# Altium schematic sheet 20.SchDoc
size 420 x 297 mm
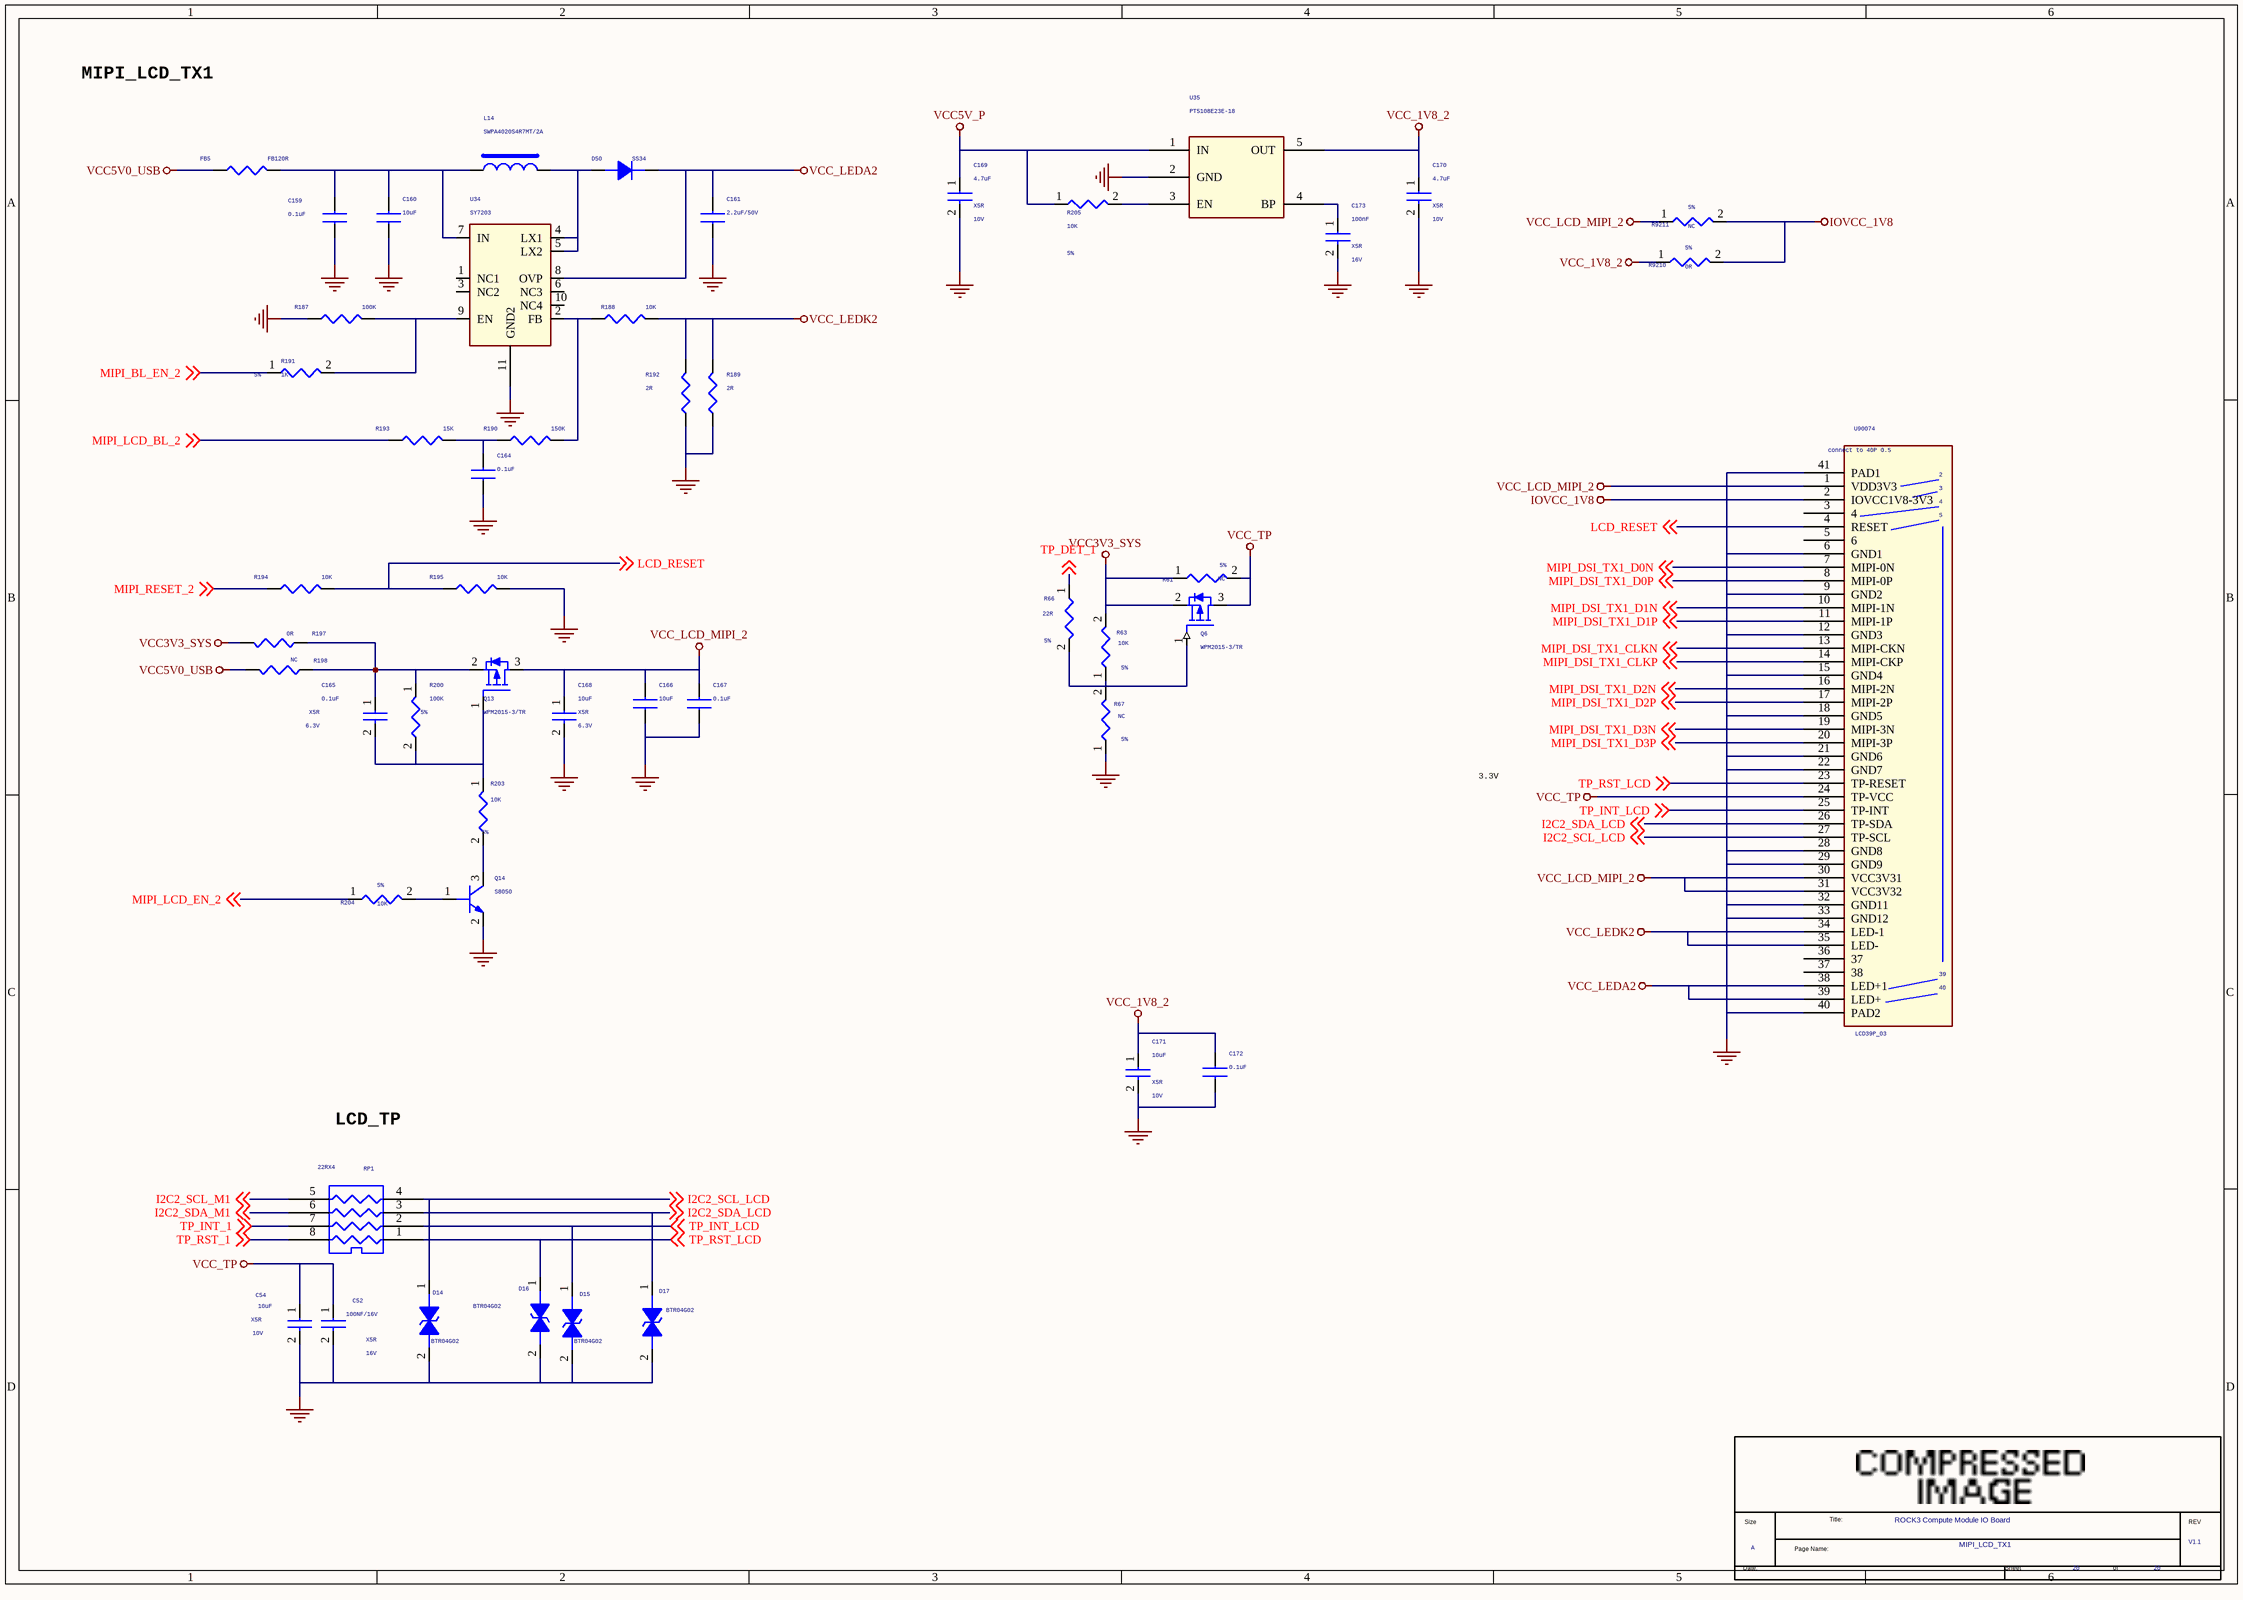
[diagram p0: 20.SchDoc]

## Parts
*  Page Count: 20  Page Size: A  Title: ROCK3 Compute Module IO Board  RevCode: V1.1  Doc: MIPI_LCD_TX1  (hidden comment: radxa_gong)  (graphical)
C52  100NF/16V  Voltage: 16V  Dielectric: X5R  [C0402]
C54  10uF  Voltage: 10V  Dielectric: X5R  [C0603]
C159  0.1uF  [C0603]
C160  10uF  [C0603]
C161  2.2uF/50V  [C0603]
C164  0.1uF  [C0603]
C165  0.1uF  Voltage: 6.3V  Dielectric: X5R  [C0402]
C166  10uF  [C0603]
C167  0.1uF  [C0603]
C168  10uF  Voltage: 6.3V  Dielectric: X5R  [C0603]
C169  4.7uF  Voltage: 10V  Dielectric: X5R  [C0603]
C170  4.7uF  Voltage: 10V  Dielectric: X5R  [C0603]
C171  10uF  Voltage: 10V  Dielectric: X5R  [C0603]
C172  0.1uF  [C0603]
C173  100nF  Voltage: 16V  Dielectric: X5R  [C0402]
D14  BTR04G02  [ESD0402_1xD5]
D15  BTR04G02  [ESD0402_1xD5]
D16  BTR04G02  [ESD0402_1xD5]
D17  BTR04G02  [ESD0402_1xD5]
D50  SS34  [DO214AC]
FB5  FB120R  [R0603]
L14  SWPA4020S4R7MT/2A  [IND-4X4]
Q6  WPM2015-3/TR  [SOT23]
Q13  WPM2015-3/TR  [SOT23]
Q14  S8050  [SOT23]
R61  NC  Tolerance: 5%  [R0402]
R63  10K  Tolerance: 5%  [R0402]
R66  22R  Tolerance: 5%  [R0402]
R67  NC  Tolerance: 5%  [R0402]
R187  100K  [R0402]
R188  10K  [R0402]
R189  2R  [R0805]
R190  150K  [R0402]
R191  1K  Tolerance: 5%  [R0402]
R192  2R  [R0805]
R193  15K  [R0402]
R194  10K  [R0402]
R195  10K  [R0402]
R197  0R  [R0603]
R198  NC  [R0603]
R200  100K  Tolerance: 5%  [R0402]
R203  10K  Tolerance: 5%  [R0402]
R204  10K  Tolerance: 5%  [R0402]
R205  10K  Tolerance: 5%  [R0402]
R9210  0R  Tolerance: 5%  [R0402]
R9211  NC  Tolerance: 5%  [R0402]
RP1  22RX4  [RN8P4RC]
U34  SY7203  [QFN8-2X2]
U35  PT5108E23E-18  [SOT25]
U90074  LCD39P_03  [LCD39PIN-ok]

## Nets
GND: C52.2 C54.2 C159.2 C160.2 C161.2 C164.1 C166.2 C167.2 C168.2 C169.2 C170.2 C171.2 C172.2 C173.2 D14.2 D15.2 D16.2 D17.2 Q14.2(EMITTER) R67.1 R187.1 R189.2 R192.2 R195.2 U34.11(GND2) U35.2(GND) U90074.6(GND1) U90074.9(GND2) U90074.12(GND3) U90074.15(GND4) U90074.18(GND5) U90074.21(GND6) U90074.22(GND7) U90074.28(GND8) U90074.29(GND9) U90074.32(GND11) U90074.33(GND12) U90074.40(PAD2) U90074.41(PAD1)
IOVCC_1V8: R9210.2 R9211.2 U90074.2(IOVCC1V8-3V3)
VCC3V3_SYS: Q6.2(SOURCE) R61.1 R63.2 R197.1
VCC5V0_USB: FB5.1 R198.1
VCC5V_P: C169.1 R205.1 U35.1(IN)
VCC_1V8_2: C170.1 C171.1 C172.1 R9210.1 U35.5(OUT)
VCC_LCD_MIPI_2: C166.1 C167.1 C168.1 Q13.3(DRAIN) R9211.1 U90074.1(VDD3V3) U90074.30(VCC3V31) U90074.31(VCC3V32)
VCC_LEDA2: C161.1 D50.2(K) U34.8(OVP) U90074.38(LED+1) U90074.39(LED+)
VCC_LEDK2: R188.2 R189.1 R192.1 U90074.34(LED-1) U90074.35(LED-)
VCC_TP: C52.1 C54.1 Q6.3(DRAIN) R61.2 U90074.24(TP-VCC)
I2C2_SCL_LCD: D14.1 RP1.4(R4) U90074.27(TP-SCL) ; off-sheet I2C2_SCL_LCD
I2C2_SCL_M1: RP1.5(R4) ; off-sheet I2C2_SCL_M1
I2C2_SDA_LCD: D17.1 RP1.3(R3) U90074.26(TP-SDA) ; off-sheet I2C2_SDA_LCD
I2C2_SDA_M1: RP1.6(R3) ; off-sheet I2C2_SDA_M1
LCD_RESET: R194.2 R195.1 U90074.4(RESET) ; off-sheet LCD_RESET
MIPI_BL_EN_2: R191.1 ; off-sheet MIPI_BL_EN_2
MIPI_DSI_TX1_CLKN: U90074.13(MIPI-CKN) ; off-sheet MIPI_DSI_TX1_CLKN
MIPI_DSI_TX1_CLKP: U90074.14(MIPI-CKP) ; off-sheet MIPI_DSI_TX1_CLKP
MIPI_DSI_TX1_D0N: U90074.7(MIPI-0N) ; off-sheet MIPI_DSI_TX1_D0N
MIPI_DSI_TX1_D0P: U90074.8(MIPI-0P) ; off-sheet MIPI_DSI_TX1_D0P
MIPI_DSI_TX1_D1N: U90074.10(MIPI-1N) ; off-sheet MIPI_DSI_TX1_D1N
MIPI_DSI_TX1_D1P: U90074.11(MIPI-1P) ; off-sheet MIPI_DSI_TX1_D1P
MIPI_DSI_TX1_D2N: U90074.16(MIPI-2N) ; off-sheet MIPI_DSI_TX1_D2N
MIPI_DSI_TX1_D2P: U90074.17(MIPI-2P) ; off-sheet MIPI_DSI_TX1_D2P
MIPI_DSI_TX1_D3N: U90074.19(MIPI-3N) ; off-sheet MIPI_DSI_TX1_D3N
MIPI_DSI_TX1_D3P: U90074.20(MIPI-3P) ; off-sheet MIPI_DSI_TX1_D3P
MIPI_LCD_BL_2: R193.1 ; off-sheet MIPI_LCD_BL_2
MIPI_LCD_EN_2: R204.1 ; off-sheet MIPI_LCD_EN_2
MIPI_RESET_2: R194.1 ; off-sheet MIPI_RESET_2
TP_DET_1: R66.1 ; off-sheet TP_DET_1
TP_INT_1: RP1.7(R2) ; off-sheet TP_INT_1
TP_INT_LCD: D15.1 RP1.2(R2) U90074.25(TP-INT) ; off-sheet TP_INT_LCD
TP_RST_1: RP1.8(R1) ; off-sheet TP_RST_1
TP_RST_LCD: D16.1 RP1.1(R1) U90074.23(TP-RESET) ; off-sheet TP_RST_LCD
NetC159_1: C159.1 C160.1 FB5.2 L14.1 U34.7(IN)
NetC164_2: C164.2 R190.1 R193.2
NetC165_1: C165.1 Q13.2(SOURCE) R197.2 R198.2 R200.1
NetC165_2: C165.2 Q13.1(GATE) R200.2 R203.1
NetC173_1: C173.1 U35.4(BP)
NetD50_1: D50.1(A) L14.2 U34.4(LX1) U34.5(LX2)
NetQ6_1: Q6.1(GATE) R63.1 R66.2 R67.2
NetQ14_1: Q14.1(BASE) R204.2
NetQ14_3: Q14.3(COLLECTOR) R203.2
NetR187_2: R187.2 R191.2 U34.9(EN)
NetR188_1: R188.1 R190.2 U34.2(FB)
NetR205_2: R205.2 U35.3(EN)

Not connected (* = marked no-connect by the designer): U34 1(NC1) 3(NC2) 6(NC3) 10(NC4); U90074 3(4) 5(6) 36(37) 37(38)

## Notes on the sheet
- MIPI_LCD_TX1
- 3.3V
- LCD_TP
- (in symbol LCD39P_03) connect to 40P 0.5
- (in symbol radxa_gong) Title:; Size; REV; Page Name:; Date:; Sheet; of

## Library data of the parts
C52 = CAP NP_Dup2: cap,100.00nF,+/-10%,16V,X5R,C0402; Manufacturer: TDK; RK PN: C1005X5R1C104K050BA; Priority: A; Tolerance: 10%; Part Type: C0402; Manufacturer PN: C1005X5R1C104K050BA; Created by: JJJ
C54 = CAP NP_Dup2: cap,10.00uF,+/-10%,10V,X5R,C0603; Manufacturer: TDK; RK PN: C1608X5R1A106K080AC; Priority: A; Tolerance: 10%; Part Type: C0603; Manufacturer PN: C1608X5R1A106K080AC; Created by: JJJ
C159 C167 C172 = CAP NP: CAP,MLCC,100nF,+/-10%,X7R,6.3V,SMD0402
C160 = CAP NP
C161 = CAP NP: RoHS CHIP CAP 1uF +10/-10% 25V X5R
C164 = CAP NP: RoHS CHIP CAP 0.1uF +10/-10% X7R
C165 = CAP NP_Dup2: cap,100.00nF,+/-10%,6.3V,X5R,C0402; Manufacturer: TDK; RK PN: C1005X5R0J104K050BA; Priority: A; Tolerance: 10%; Part Type: C0402; Manufacturer PN: C1005X5R0J104K050BA; Created by: JJJ
C166 = CAP NP: CAP,MLCC,4.7uF,+/-10%,X5R,6.3V,SMD0603
C168 = CAP NP_Dup2: cap,4.70uF,+/-10%,6.3V,X5R,C0603; Manufacturer: TDK; RK PN: C1608X5R0J475K080AB; Priority: A; Tolerance: 10%; Part Type: C0603; Manufacturer PN: C1608X5R0J475K080AB; Created by: JJJ
C169 = CAP NP_Dup2: cap,4.70uF,+/-10%,10V,X5R,C0603; Manufacturer PN: C1608X5R1A475K080AC; Manufacturer: TDK; Tolerance: 10%; Priority: A; Created by: JJJ; Part Type: C0603; RK PN: C1608X5R1A475K080AC
C170 = CAP NP_Dup2: cap,4.70uF,+/-10%,10V,X5R,C0603; Manufacturer: TDK; RK PN: C1608X5R1A475K080AC; Priority: A; Tolerance: 10%; Part Type: C0603; Manufacturer PN: C1608X5R1A475K080AC; Created by: JJJ
C171 = CAP NP_Dup2: cap,10.00uF,+/-10%,10V,X5R,C0805; Manufacturer: TDK; RK PN: C2012X5R1A106K125AB; Priority: A; Tolerance: 10%; Part Type: C0805; Manufacturer PN: C2012X5R1A106K125AB; Created by: JJJ
C173 = CAP NP_Dup2: cap,100.00nF,+/-10%,16V,X5R,C0402; Manufacturer PN: C1005X5R1C104K050BA; Manufacturer: TDK; Tolerance: 10%; Priority: A; Created by: JJJ; Part Type: C0402; RK PN: C1005X5R1C104K050BA
D14 = DIODE BI_DIR TRIG: 1-Line, Bi-directional, Transient Voltage Suppressors.17.5pF.; Manufacturer PN: ESD5451N; Manufacturer: WillSemi(韦尔半导体); OPTION: DNP; Priority: A; Created by: JJJ; Part Type: ESD_TVS; RK PN: ESD5451N
D15-D17 = DIODE BI_DIR TRIG: 1-Line, Bi-directional, Transient Voltage Suppressors.17.5pF.; Manufacturer: WillSemi(韦尔半导体); RK PN: ESD5451N; Priority: A; OPTION: DNP; Part Type: ESD_TVS; Manufacturer PN: ESD5451N; Created by: JJJ
D50 = DIODE
FB5 R187 R190 R193-R195 = RES 1B: ROHS CHIP RES 4.7K 1/16W 5%
L14 = INDUCTORS OF FERRITE
Q6 = MOSFET P: PMOS,WPM2015-3/TR,SOT_23,Id=2.4A,Vds=20V; Manufacturer: WillSemi(韦尔半导体); option: DNP; Pd: 0.5W; Vgsth: 0.62V; VDS: 20V; Vgs: ±8V; Id_max: 2.4A; Priority: A; ROOM: CHG; Created by: JJJ; Manufacturer PN: WPM2015-3/TR; Part Type: PMOS; RK PN: WPM2015-3/TR
Q13 = MOSFET P_Dup1: PMOS,WPM2015-3/TR,SOT23,Id=2.4A,Vds=20V; Manufacturer: WillSemi(韦尔半导体); Priority: A; Id: 2.4A; Vgs: ±8V; VDS: 20V; Vgsth: 0.62V; Pd: 0.5W; RK PN: WPM2015-3/TR; Part Type: PMOS; Manufacturer PN: WPM2015-3/TR; Created by: JJJ
Q14 = NPN: S8050 SOT23; Manufacturer PN: S8050_SOT23; Manufacturer: 长电; Pc: 0.3W; Vceo: 25V; Ic: 0.5A; Priority: A; Created by: JJJ; Part Type: NPN; RK PN: S8050
R61 = RESISTOR_Dup1: 通用厚膜电阻,0R,+/-5%,R0402,1/16W.; Manufacturer: YAGEO; RK PN: RC0402JR-070RL; Priority: A; Wattage: 1/16W; Part Type: 通用厚膜电阻; Manufacturer PN: RC0402JR-070RL; Created by: YTL
R63 R203-R205 R9210 = RESISTOR_Dup1: 通用厚膜电阻,10K,+/-5%,R0402,1/16W.; Manufacturer: YAGEO; RK PN: RC0402JR-0710KL; Priority: A; Wattage: 1/16W; Part Type: 通用厚膜电阻; Manufacturer PN: RC0402JR-0710KL; Created by: YTL
R66 = RESISTOR_Dup1: 通用厚膜电阻,100K,+/-5%,R0402,1/16W.; Manufacturer PN: RC0402JR-07100KL; Manufacturer: YAGEO; Wattage: 1/16W; Priority: A; Created by: YTL; Part Type: 通用厚膜电阻; RK PN: RC0402JR-07100KL
R67 R191 R9211 = RESISTOR_Dup1: 通用厚膜电阻,10K,+/-5%,R0402,1/16W.; Manufacturer PN: RC0402JR-0710KL; Manufacturer: YAGEO; Wattage: 1/16W; Priority: A; Created by: YTL; Part Type: 通用厚膜电阻; RK PN: RC0402JR-0710KL
R188 = RES 1B: ROHS CHIP RES 82K 1/16W 5%
R189 R192 R197 R198 = RES 1B: ROHS CHIP RES 4.7R 1/4W 5%
R200 = RESISTOR_Dup1: 通用厚膜电阻,100K,+/-5%,R0402,1/16W.; Manufacturer: YAGEO; RK PN: RC0402JR-07100KL; Priority: A; Wattage: 1/16W; Part Type: 通用厚膜电阻; Manufacturer PN: RC0402JR-07100KL; Created by: YTL
RP1 = R-PACK4
U34 = MP3202-QFN8_1
U35 = LDO_PT5108: 500mA, Low Dropout, Low Noise Ultra-Fast Without Bypass Capacitor CMOS LDO Regulator; Manufacturer PN: RT9013-30GB; Manufacturer: Richtek（立錡）; Priority: A; RK PN: RT9013-30B; Option: /CE75B30M; Created by: JJJ; Part Type: LDO
* = radxa_gong: Page Number: 20; Page Create Date: March  8, 1995